# Altium schematic sheet BoardConnectors.SchDoc
size A4; Date: 07.06.2021; Author: Mateusz Mróz; CompanyName: AGH; SheetNumber: 3; SheetTotal: 4
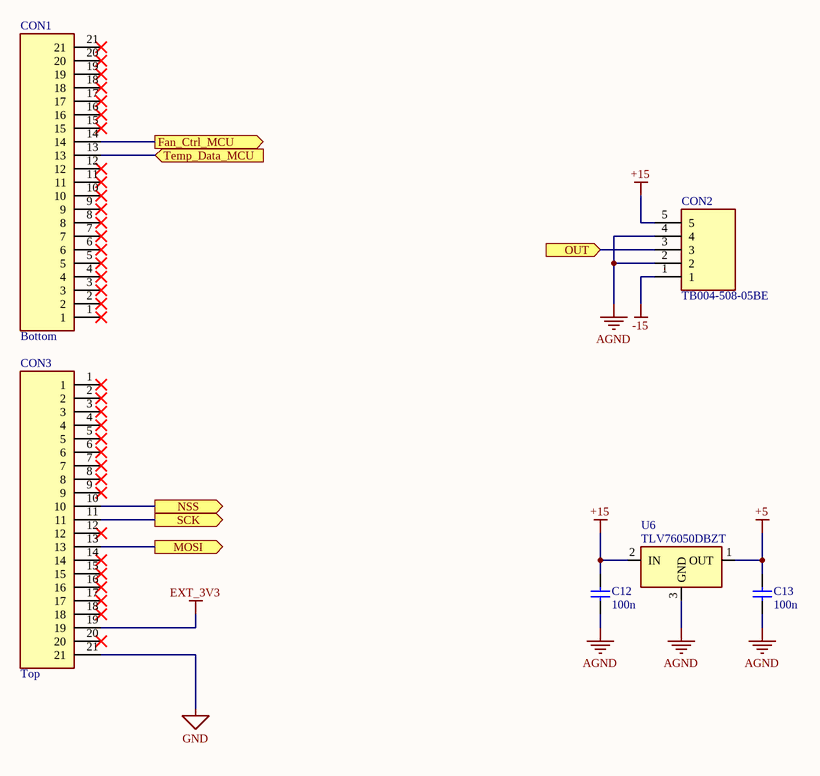
[diagram p0: BoardConnectors.SchDoc]

## Parts
C12  100n  [Cap_0603_MD_outline]
C13  100n  [Cap_0603_MD_outline]
CON1  Location: Bottom  [SOCKET_1X21_2.54]  (hidden comment: Socket 21)
CON2  TB004-508-05BE  [TB00450805BE]
CON3  Location: Top  [SOCKET_1X21_2.54]  (hidden comment: Socket 21)
U6  TLV76050DBZT  [SOT95P237X112-3N]

## Ports
Fan_Ctrl_MCU (out), MOSI (out), NSS (out), OUT (in), SCK (out), Temp_Data_MCU (in)

## Nets
+5: C13.2 U6.1(OUT)
+15: C12.2 CON2.5 U6.2(IN)
-15: CON2.1
AGND: C12.1 C13.1 CON2.2 CON2.4 U6.3(GND)
EXT_3V3: CON3.19
GND: CON3.21
Fan_Ctrl_MCU: CON1.14 ; port Fan_Ctrl_MCU
MOSI: CON3.13 ; port MOSI
NSS: CON3.10 ; port NSS
OUT: CON2.3 ; port OUT
SCK: CON3.11 ; port SCK
Temp_Data_MCU: CON1.13 ; port Temp_Data_MCU

Not connected (* = marked no-connect by the designer): CON1 1* 2* 3* 4* 5* 6* 7* 8* 9* 10* 11* 12* 15* 16* 17* 18* 19* 20* 21*; CON3 1* 2* 3* 4* 5* 6* 7* 8* 9* 12* 14* 15* 16* 17* 18* 20*

## Notes on the sheet
- University name:
- Degree course:
- 3th year electronics
- Date:
- Author:
- Student Index:
- Course:
- Checked by:
- PUE
- dr hab. inż. Cezary Worek, prof. AGH
- 305093
- Project name:
- Document name:
- Variant name:
- Sheet/all:
- /
- Version number:

## Library data of the parts
C12 C13 = Capacitor: MPN: GRM188R72A104KA35; Value: 100n; Package: 0603
CON1 CON3 = Socket 21: Socket, 21-Pin; System: Connector; MPN: *
CON2 = TB004-508-05BE: Terminal Block Screw; MPN: TB004-508-05BE
U6 = TLV76050DBZT: Voltage Regulator 5V; MPN: TLV76050DBZT